# EAGLE design phoney text (EAGLE 9.6.2)
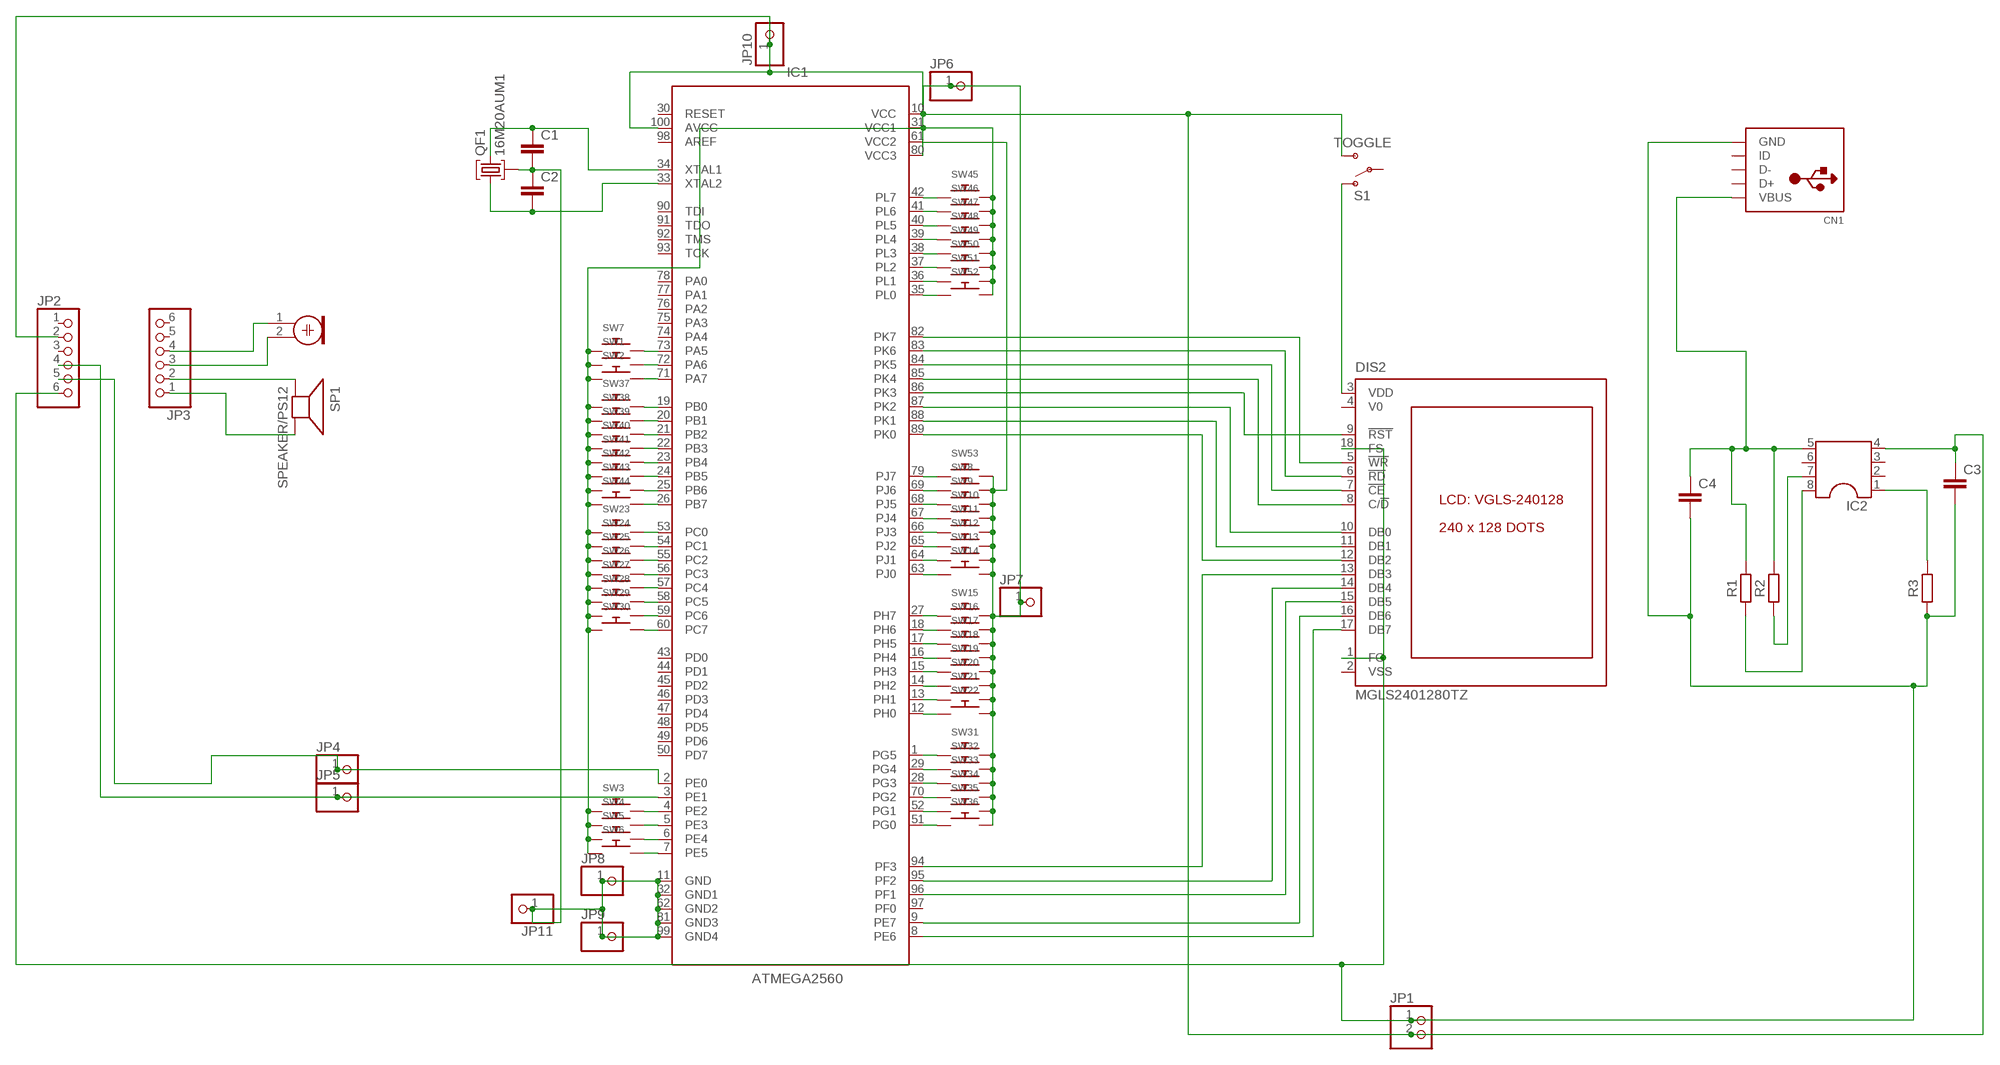
[diagram p0: schematic, sheet 1]

## Parts
C1  C2,5-3  [C2.5-3]
C2  C2,5-3  [C2.5-3]
C3  C2.5/2  [C2.5-2]
C4  C2.5/2  [C2.5-2]
CN1  USBMOLEX  [USB-MINIB-THM-MOLEX]
DIS2  MGLS2401280TZ  [MGLS2401280TZ]
IC1  ATMEGA2560  ATMEGA2560-16AUR_QFP  [QFP50P1600X1600X160-100N]
IC2  DIL8  [DIL08]
JP1  PINHD-1X2  [1X02]
JP2  PINHD-1X6CB  [1X06-CLEANBIG]
JP3  PINHD-1X6CB  [1X06-CLEANBIG]
JP4  PINHD-1X1  [1X01]
JP5  PINHD-1X1  [1X01]
JP6  PINHD-1X1  [1X01]
JP7  PINHD-1X1  [1X01]
JP8  PINHD-1X1  [1X01]
JP9  PINHD-1X1  [1X01]
JP10  PINHD-1X1  [1X01]
JP11  PINHD-1X1  [1X01]
M1  ELECTRET_MICROPHON-F6050AP  [F6050AP]
QF1  16M20AUM1  [UM1]
R1  R_CHIP-0603(1608-METRIC)  [RESC1608X60]
R2  R_CHIP-0603(1608-METRIC)  [RESC1608X60]
R3  R_CHIP-0603(1608-METRIC)  [RESC1608X60]
S1  TOGGLE  [SWITCH-SPDT-PTH-8.5X3.7MM]
SP1  SPEAKER/PS12  [PS12]
SW1  SWITCH_PUSHBUTTONSOFTTOUCHSMD_SJ  [PUSHBUTTON_SMD_SJ]
SW2  SWITCH_PUSHBUTTONSOFTTOUCHSMD_SJ  [PUSHBUTTON_SMD_SJ]
SW3  SWITCH_PUSHBUTTONSOFTTOUCHSMD_SJ  [PUSHBUTTON_SMD_SJ]
SW4  SWITCH_PUSHBUTTONSOFTTOUCHSMD_SJ  [PUSHBUTTON_SMD_SJ]
SW5  SWITCH_PUSHBUTTONSOFTTOUCHSMD_SJ  [PUSHBUTTON_SMD_SJ]
SW6  SWITCH_PUSHBUTTONSOFTTOUCHSMD_SJ  [PUSHBUTTON_SMD_SJ]
SW7  SWITCH_PUSHBUTTONSOFTTOUCHSMD_SJ  [PUSHBUTTON_SMD_SJ]
SW8  SWITCH_PUSHBUTTONSOFTTOUCHSMD_SJ  [PUSHBUTTON_SMD_SJ]
SW9  SWITCH_PUSHBUTTONSOFTTOUCHSMD_SJ  [PUSHBUTTON_SMD_SJ]
SW10  SWITCH_PUSHBUTTONSOFTTOUCHSMD_SJ  [PUSHBUTTON_SMD_SJ]
SW11  SWITCH_PUSHBUTTONSOFTTOUCHSMD_SJ  [PUSHBUTTON_SMD_SJ]
SW12  SWITCH_PUSHBUTTONSOFTTOUCHSMD_SJ  [PUSHBUTTON_SMD_SJ]
SW13  SWITCH_PUSHBUTTONSOFTTOUCHSMD_SJ  [PUSHBUTTON_SMD_SJ]
SW14  SWITCH_PUSHBUTTONSOFTTOUCHSMD_SJ  [PUSHBUTTON_SMD_SJ]
SW15  SWITCH_PUSHBUTTONSOFTTOUCHSMD_SJ  [PUSHBUTTON_SMD_SJ]
SW16  SWITCH_PUSHBUTTONSOFTTOUCHSMD_SJ  [PUSHBUTTON_SMD_SJ]
SW17  SWITCH_PUSHBUTTONSOFTTOUCHSMD_SJ  [PUSHBUTTON_SMD_SJ]
SW18  SWITCH_PUSHBUTTONSOFTTOUCHSMD_SJ  [PUSHBUTTON_SMD_SJ]
SW19  SWITCH_PUSHBUTTONSOFTTOUCHSMD_SJ  [PUSHBUTTON_SMD_SJ]
SW20  SWITCH_PUSHBUTTONSOFTTOUCHSMD_SJ  [PUSHBUTTON_SMD_SJ]
SW21  SWITCH_PUSHBUTTONSOFTTOUCHSMD_SJ  [PUSHBUTTON_SMD_SJ]
SW22  SWITCH_PUSHBUTTONSOFTTOUCHSMD_SJ  [PUSHBUTTON_SMD_SJ]
SW23  SWITCH_PUSHBUTTONSOFTTOUCHSMD_SJ  [PUSHBUTTON_SMD_SJ]
SW24  SWITCH_PUSHBUTTONSOFTTOUCHSMD_SJ  [PUSHBUTTON_SMD_SJ]
SW25  SWITCH_PUSHBUTTONSOFTTOUCHSMD_SJ  [PUSHBUTTON_SMD_SJ]
SW26  SWITCH_PUSHBUTTONSOFTTOUCHSMD_SJ  [PUSHBUTTON_SMD_SJ]
SW27  SWITCH_PUSHBUTTONSOFTTOUCHSMD_SJ  [PUSHBUTTON_SMD_SJ]
SW28  SWITCH_PUSHBUTTONSOFTTOUCHSMD_SJ  [PUSHBUTTON_SMD_SJ]
SW29  SWITCH_PUSHBUTTONSOFTTOUCHSMD_SJ  [PUSHBUTTON_SMD_SJ]
SW30  SWITCH_PUSHBUTTONSOFTTOUCHSMD_SJ  [PUSHBUTTON_SMD_SJ]
SW31  SWITCH_PUSHBUTTONSOFTTOUCHSMD_SJ  [PUSHBUTTON_SMD_SJ]
SW32  SWITCH_PUSHBUTTONSOFTTOUCHSMD_SJ  [PUSHBUTTON_SMD_SJ]
SW33  SWITCH_PUSHBUTTONSOFTTOUCHSMD_SJ  [PUSHBUTTON_SMD_SJ]
SW34  SWITCH_PUSHBUTTONSOFTTOUCHSMD_SJ  [PUSHBUTTON_SMD_SJ]
SW35  SWITCH_PUSHBUTTONSOFTTOUCHSMD_SJ  [PUSHBUTTON_SMD_SJ]
SW36  SWITCH_PUSHBUTTONSOFTTOUCHSMD_SJ  [PUSHBUTTON_SMD_SJ]
SW37  SWITCH_PUSHBUTTONSOFTTOUCHSMD_SJ  [PUSHBUTTON_SMD_SJ]
SW38  SWITCH_PUSHBUTTONSOFTTOUCHSMD_SJ  [PUSHBUTTON_SMD_SJ]
SW39  SWITCH_PUSHBUTTONSOFTTOUCHSMD_SJ  [PUSHBUTTON_SMD_SJ]
SW40  SWITCH_PUSHBUTTONSOFTTOUCHSMD_SJ  [PUSHBUTTON_SMD_SJ]
SW41  SWITCH_PUSHBUTTONSOFTTOUCHSMD_SJ  [PUSHBUTTON_SMD_SJ]
SW42  SWITCH_PUSHBUTTONSOFTTOUCHSMD_SJ  [PUSHBUTTON_SMD_SJ]
SW43  SWITCH_PUSHBUTTONSOFTTOUCHSMD_SJ  [PUSHBUTTON_SMD_SJ]
SW44  SWITCH_PUSHBUTTONSOFTTOUCHSMD_SJ  [PUSHBUTTON_SMD_SJ]
SW45  SWITCH_PUSHBUTTONSOFTTOUCHSMD_SJ  [PUSHBUTTON_SMD_SJ]
SW46  SWITCH_PUSHBUTTONSOFTTOUCHSMD_SJ  [PUSHBUTTON_SMD_SJ]
SW47  SWITCH_PUSHBUTTONSOFTTOUCHSMD_SJ  [PUSHBUTTON_SMD_SJ]
SW48  SWITCH_PUSHBUTTONSOFTTOUCHSMD_SJ  [PUSHBUTTON_SMD_SJ]
SW49  SWITCH_PUSHBUTTONSOFTTOUCHSMD_SJ  [PUSHBUTTON_SMD_SJ]
SW50  SWITCH_PUSHBUTTONSOFTTOUCHSMD_SJ  [PUSHBUTTON_SMD_SJ]
SW51  SWITCH_PUSHBUTTONSOFTTOUCHSMD_SJ  [PUSHBUTTON_SMD_SJ]
SW52  SWITCH_PUSHBUTTONSOFTTOUCHSMD_SJ  [PUSHBUTTON_SMD_SJ]
SW53  SWITCH_PUSHBUTTONSOFTTOUCHSMD_SJ  [PUSHBUTTON_SMD_SJ]

## Nets
N$1: IC1.2(PE0) JP2.5 JP4.1
N$2: IC1.3(PE1) JP2.4 JP5.1
N$5: C3.1 IC1.10(VCC) IC1.61(VCC2) IC1.80(VCC3) IC1.100(AVCC) IC2.4 JP1.2 JP2.2 JP6.1 JP7.1 JP10.1 S1.3(S) SW8.P$2 SW9.P$2 SW10.P$2 SW11.P$2 SW12.P$2 SW13.P$2 SW14.P$2 SW15.P$2 SW16.P$2 SW17.P$2 SW18.P$2 SW19.P$2 SW20.P$2 SW21.P$2 SW22.P$2 SW31.P$2 SW32.P$2 SW33.P$2 SW34.P$2 SW35.P$2 SW36.P$2 SW53.P$2
N$6: DIS2.17(DB7) IC1.8(PE6)
N$7: DIS2.12(DB2) IC1.89(PK0)
N$8: DIS2.11(DB1) IC1.88(PK1)
N$9: DIS2.10(DB0) IC1.87(PK2)
N$11: DIS2.9(!RST) IC1.86(PK3)
N$12: DIS2.8(C/!D) IC1.85(PK4)
N$13: DIS2.7(!CE) IC1.84(PK5)
N$14: DIS2.6(!RD) IC1.83(PK6)
N$15: DIS2.5(!WR) IC1.82(PK7)
N$16: IC1.73(PA5) SW7.P$2
N$17: IC1.72(PA6) SW1.P$2
N$18: IC1.71(PA7) SW2.P$2
N$19: IC1.19(PB0) SW37.P$2
N$20: IC1.20(PB1) SW38.P$2
N$21: IC1.21(PB2) SW39.P$2
N$22: IC1.22(PB3) SW40.P$2
N$23: IC1.23(PB4) SW41.P$2
N$24: IC1.24(PB5) SW42.P$2
N$25: IC1.25(PB6) SW43.P$2
N$26: IC1.26(PB7) SW44.P$2
N$27: IC1.53(PC0) SW23.P$2
N$28: IC1.54(PC1) SW24.P$2
N$29: IC1.55(PC2) SW25.P$2
N$30: IC1.56(PC3) SW26.P$2
N$31: IC1.57(PC4) SW27.P$2
N$32: IC1.58(PC5) SW28.P$2
N$33: IC1.59(PC6) SW29.P$2
N$34: IC1.60(PC7) SW30.P$2
N$35: IC1.69(PJ6) SW8.P$1
N$36: IC1.68(PJ5) SW9.P$1
N$37: IC1.67(PJ4) SW10.P$1
N$38: IC1.66(PJ3) SW11.P$1
N$39: IC1.65(PJ2) SW12.P$1
N$40: IC1.64(PJ1) SW13.P$1
N$41: IC1.63(PJ0) SW14.P$1
N$42: IC1.27(PH7) SW15.P$1
N$43: IC1.18(PH6) SW16.P$1
N$44: IC1.17(PH5) SW17.P$1
N$45: IC1.16(PH4) SW18.P$1
N$46: IC1.15(PH3) SW19.P$1
N$47: IC1.14(PH2) SW20.P$1
N$48: IC1.13(PH1) SW21.P$1
N$49: IC1.12(PH0) SW22.P$1
N$50: IC1.1(PG5) SW31.P$1
N$51: IC1.29(PG4) SW32.P$1
N$52: IC1.28(PG3) SW33.P$1
N$53: IC1.70(PG2) SW34.P$1
N$54: IC1.52(PG1) SW35.P$1
N$55: IC1.51(PG0) SW36.P$1
N$56: IC1.42(PL7) SW45.P$1
N$57: IC1.41(PL6) SW46.P$1
N$58: IC1.40(PL5) SW47.P$1
N$59: IC1.39(PL4) SW48.P$1
N$60: IC1.38(PL3) SW49.P$1
N$61: IC1.37(PL2) SW50.P$1
N$62: IC1.36(PL1) SW51.P$1
N$63: IC1.35(PL0) SW52.P$1
N$64: IC1.4(PE2) SW3.P$2
N$65: IC1.5(PE3) SW4.P$2
N$66: IC1.6(PE4) SW5.P$2
N$67: IC1.7(PE5) SW6.P$2
N$69: IC1.31(VCC1) SW1.P$1 SW2.P$1 SW3.P$1 SW4.P$1 SW5.P$1 SW6.P$1 SW7.P$1 SW23.P$1 SW24.P$1 SW25.P$1 SW26.P$1 SW27.P$1 SW28.P$1 SW29.P$1 SW30.P$1 SW37.P$1 SW38.P$1 SW39.P$1 SW40.P$1 SW41.P$1 SW42.P$1 SW43.P$1 SW44.P$1 SW45.P$2 SW46.P$2 SW47.P$2 SW48.P$2 SW49.P$2 SW50.P$2 SW51.P$2 SW52.P$2
N$72: IC1.79(PJ7) SW53.P$1
N$73: DIS2.3(VDD) S1.1(O)
N$74: C1.2 C2.1 IC1.11(GND) IC1.32(GND1) IC1.62(GND2) IC1.81(GND3) IC1.99(GND4) JP8.1 JP9.1 JP11.1 QF1.2
N$75: C1.1 IC1.34(XTAL1) QF1.3
N$76: C2.2 IC1.33(XTAL2) QF1.1
N$78: IC2.1 R3.2
N$79: IC2.8 R1.1
N$80: IC2.7 R2.1
N$81: C4.1 CN1.VBUS IC2.5 R1.2 R2.2
N$83: DIS2.13(DB3) IC1.94(PF3)
N$84: DIS2.14(DB4) IC1.95(PF2)
N$85: C3.2 C4.2 CN1.GND DIS2.1(FG) DIS2.18(FS) JP1.1 JP2.6 R3.1
N$86: JP3.1 SP1.P$2(-)
N$87: JP3.2 SP1.P$1(+)
N$88: JP3.3 M1.2
N$89: JP3.4 M1.1
N$90: DIS2.15(DB5) IC1.96(PF1)
N$91: DIS2.16(DB6) IC1.9(PE7)
Unconnected: CN1.D+ CN1.D- CN1.ID DIS2.2(VSS) DIS2.4(V0) IC1.30(RESET) IC1.43(PD0) IC1.44(PD1) IC1.45(PD2) IC1.46(PD3) IC1.47(PD4) IC1.48(PD5) IC1.49(PD6) IC1.50(PD7) IC1.74(PA4) IC1.75(PA3) IC1.76(PA2) IC1.77(PA1) IC1.78(PA0) IC1.90(TDI) IC1.91(TDO) IC1.92(TMS) IC1.93(TCK) IC1.97(PF0) IC1.98(AREF) IC2.2 IC2.3 IC2.6 JP2.1 JP2.3 JP3.5 JP3.6 S1.2(P)

## Library data of the parts
C1-C4 = capacitor-wima:C: CAPACITOR naming: grid - package width
CN1 = adafruit:USB: USB Connectors USBMINIB - Surface Mount Female Mini-B USB Connector 4UConnector: 06564 By microbuilder.eu Thru-hole RA Female Mini-B USB Connector 4UConnector: 18732 By ladyada.net
DIS2 = display-lcd:MGLS2401280TZ: LCD Display 240 x 128 Dots Source: VARITRONIX LIMITED .. LCD_f1187192714.pdf; OC_FARNELL: 1183196; OC_NEWARK: unknown
IC1 = IC_Embedded:ATMEGA2560*: 8-bit Microcontroller with 16/32/64KB In-System Programmable Flash Datasheet <https://ww1.microchip.com/downloads/en/DeviceDoc/ATmega640-1280-1281-2560-2561-Datasheet-DS40002211A.pdf>; CATEGORY: IC_Embedded; DESCRIPTION: IC MCU 8BIT 256KB FLASH 100TQFP; MANUFACTURER: Microchip Technology; MPN: ATMEGA2560-16AUR; OPERATING_TEMP: -40°C to 85°C; PART_STATUS: Active; SERIES: AVR® ATmega; SPEED: 16MHz; SUB-CATEGORY: Microcontroller
IC2 = ic-package:DIL8: Dual In Line / Socket
JP1 = pinhead:PINHD-1X2: PIN HEADER
JP2 JP3 = adafruit:PINHD-1X6: PIN HEADER
JP4-JP9 = pinhead:PINHD-1X1: PIN HEADER
JP10 JP11 = adafruit:PINHD-1X1: Pin header 1x1 for 0.1" spacing With round pins
M1 = microphon:ELECTRET_MICROPHON-: Electret Condenser Microphone
QF1 = crystal:16M20AUM1: Monolithic Crystal Filters Source: www.vanlong.com; OC_FARNELL: unknown; OC_NEWARK: unknown
R1-R3 = Resistor:R: Resistor Fixed - Generic; CATEGORY: Resistor; SUB-CATEGORY: Fixed
S1 = Tinkercad:TOGGLE
SP1 = adafruit:SPEAKER: SPEAKER Source: Buerklin Added PS12 (for part # PS1240 piezo) http://www.ladyada.net/library/pcb/eaglelibrary.html
SW1-SW53 = adafruit:SWITCH_PUSHBUTTON: Buttons SOFTTOUCHSMD_SJ - Soft touch temporary push button (Super Junk Akihabara) Compatible with SKPMANE010 [Mouser: 688-SKPMAN] C&K_KSS = Digikey: KSS221GLFS

## Board
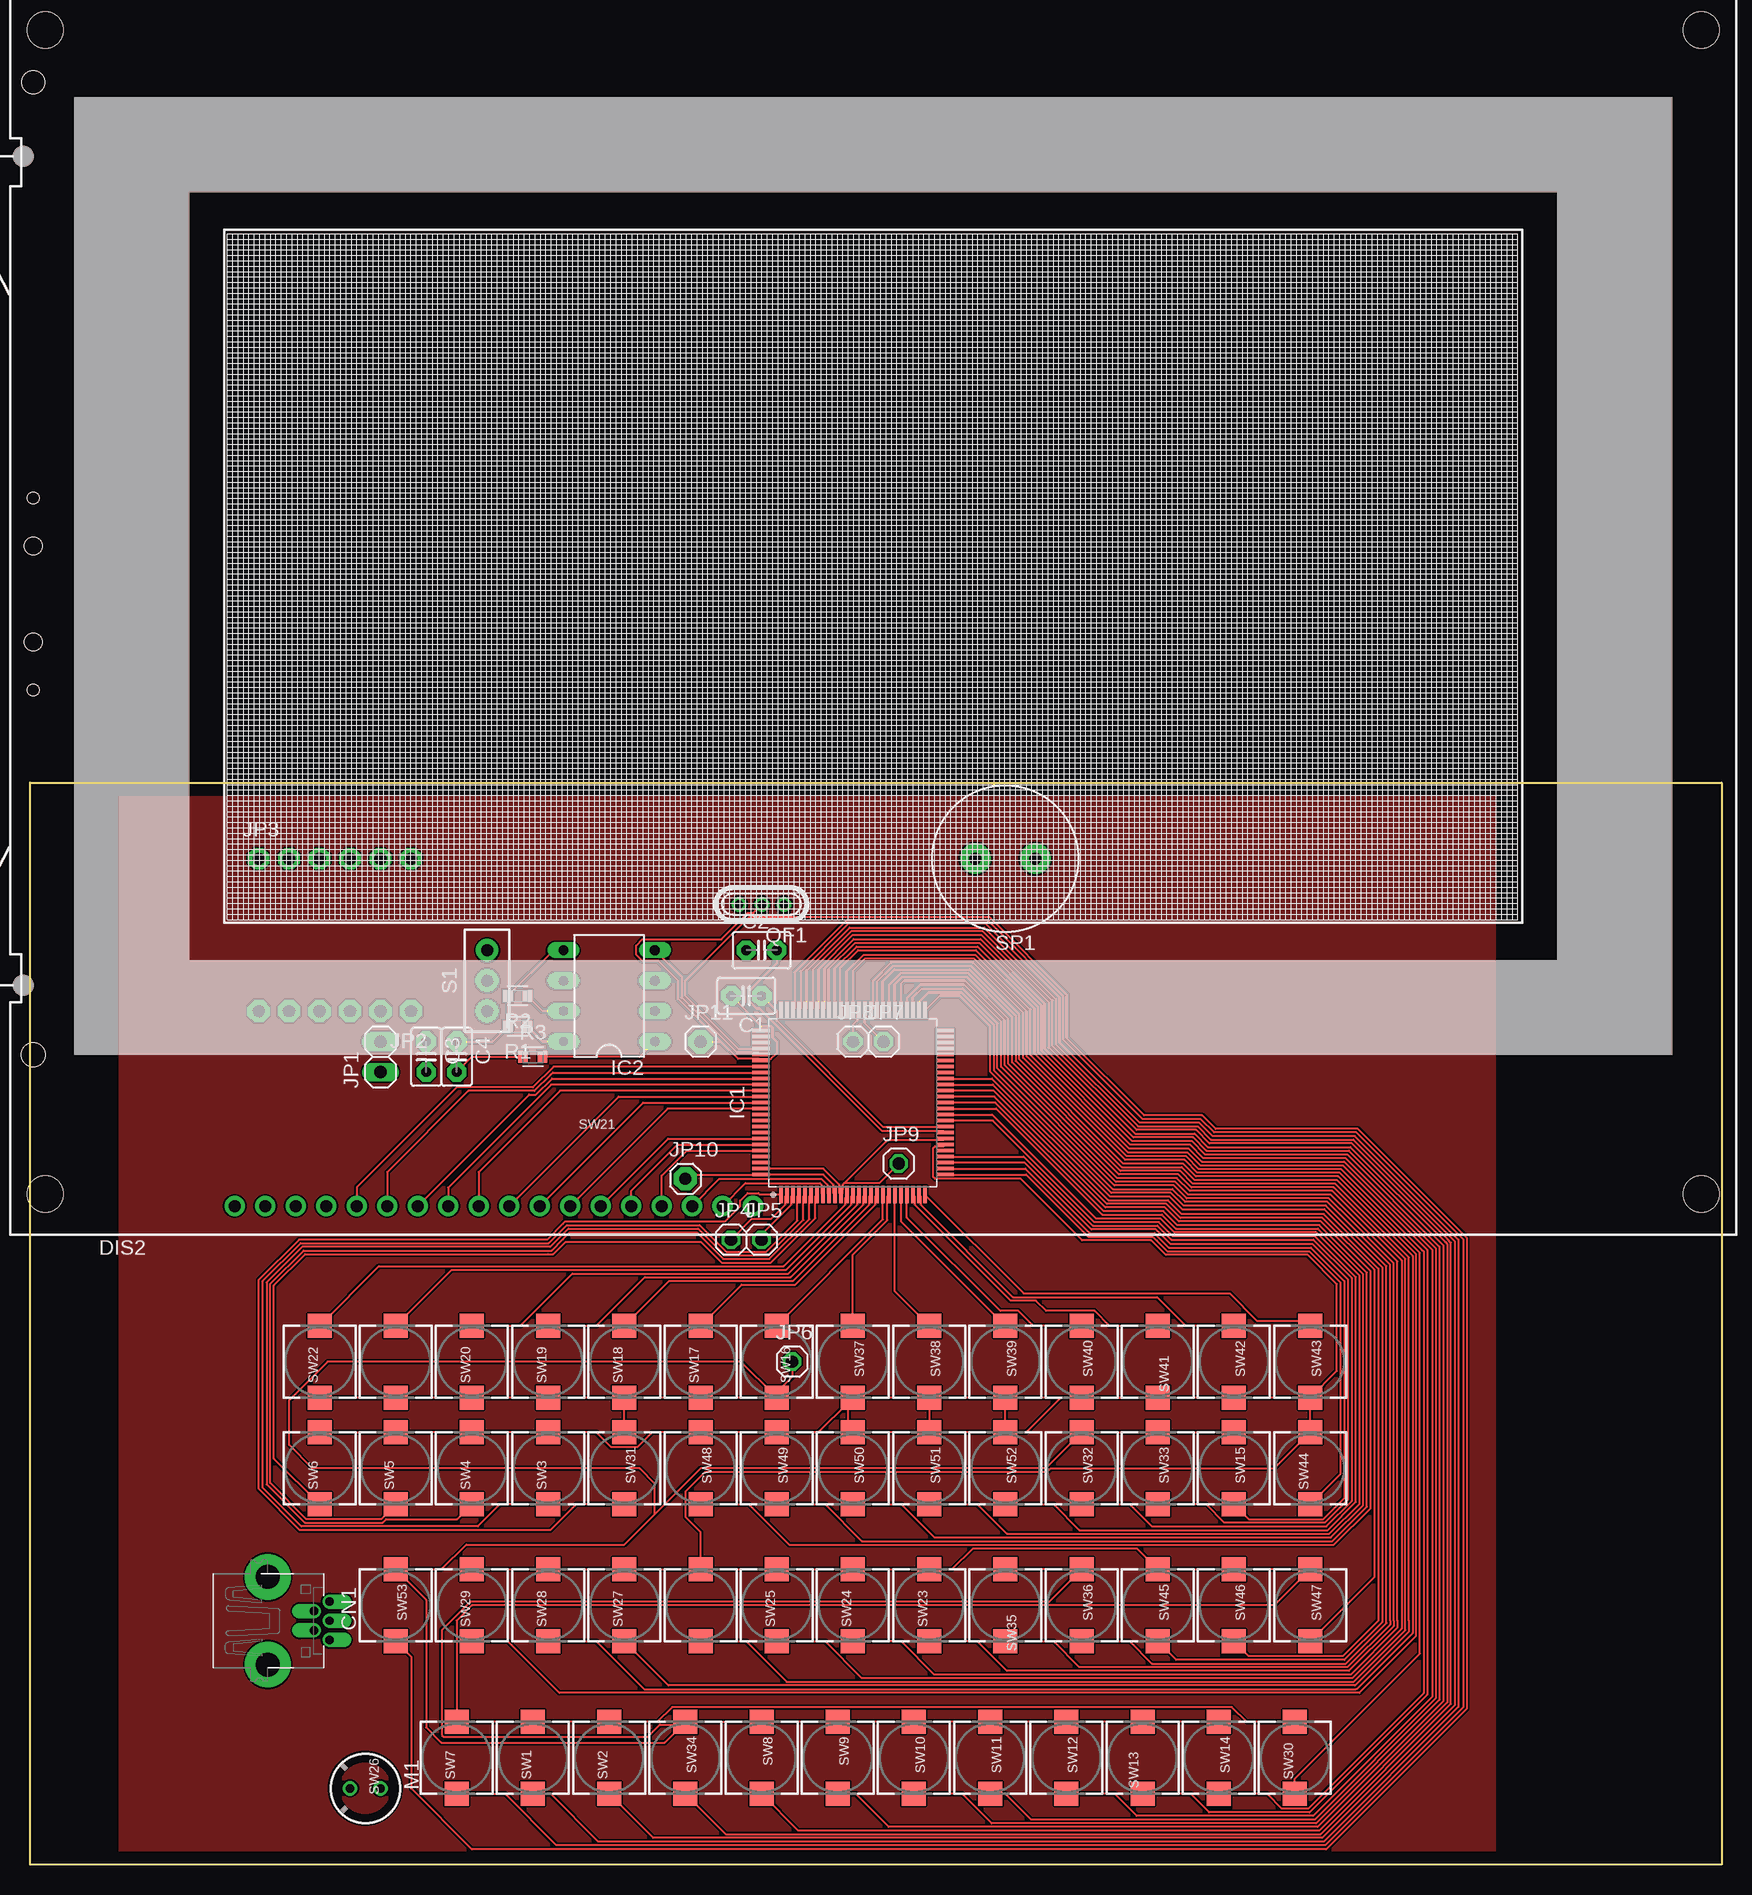
[diagram p1: board, top side]
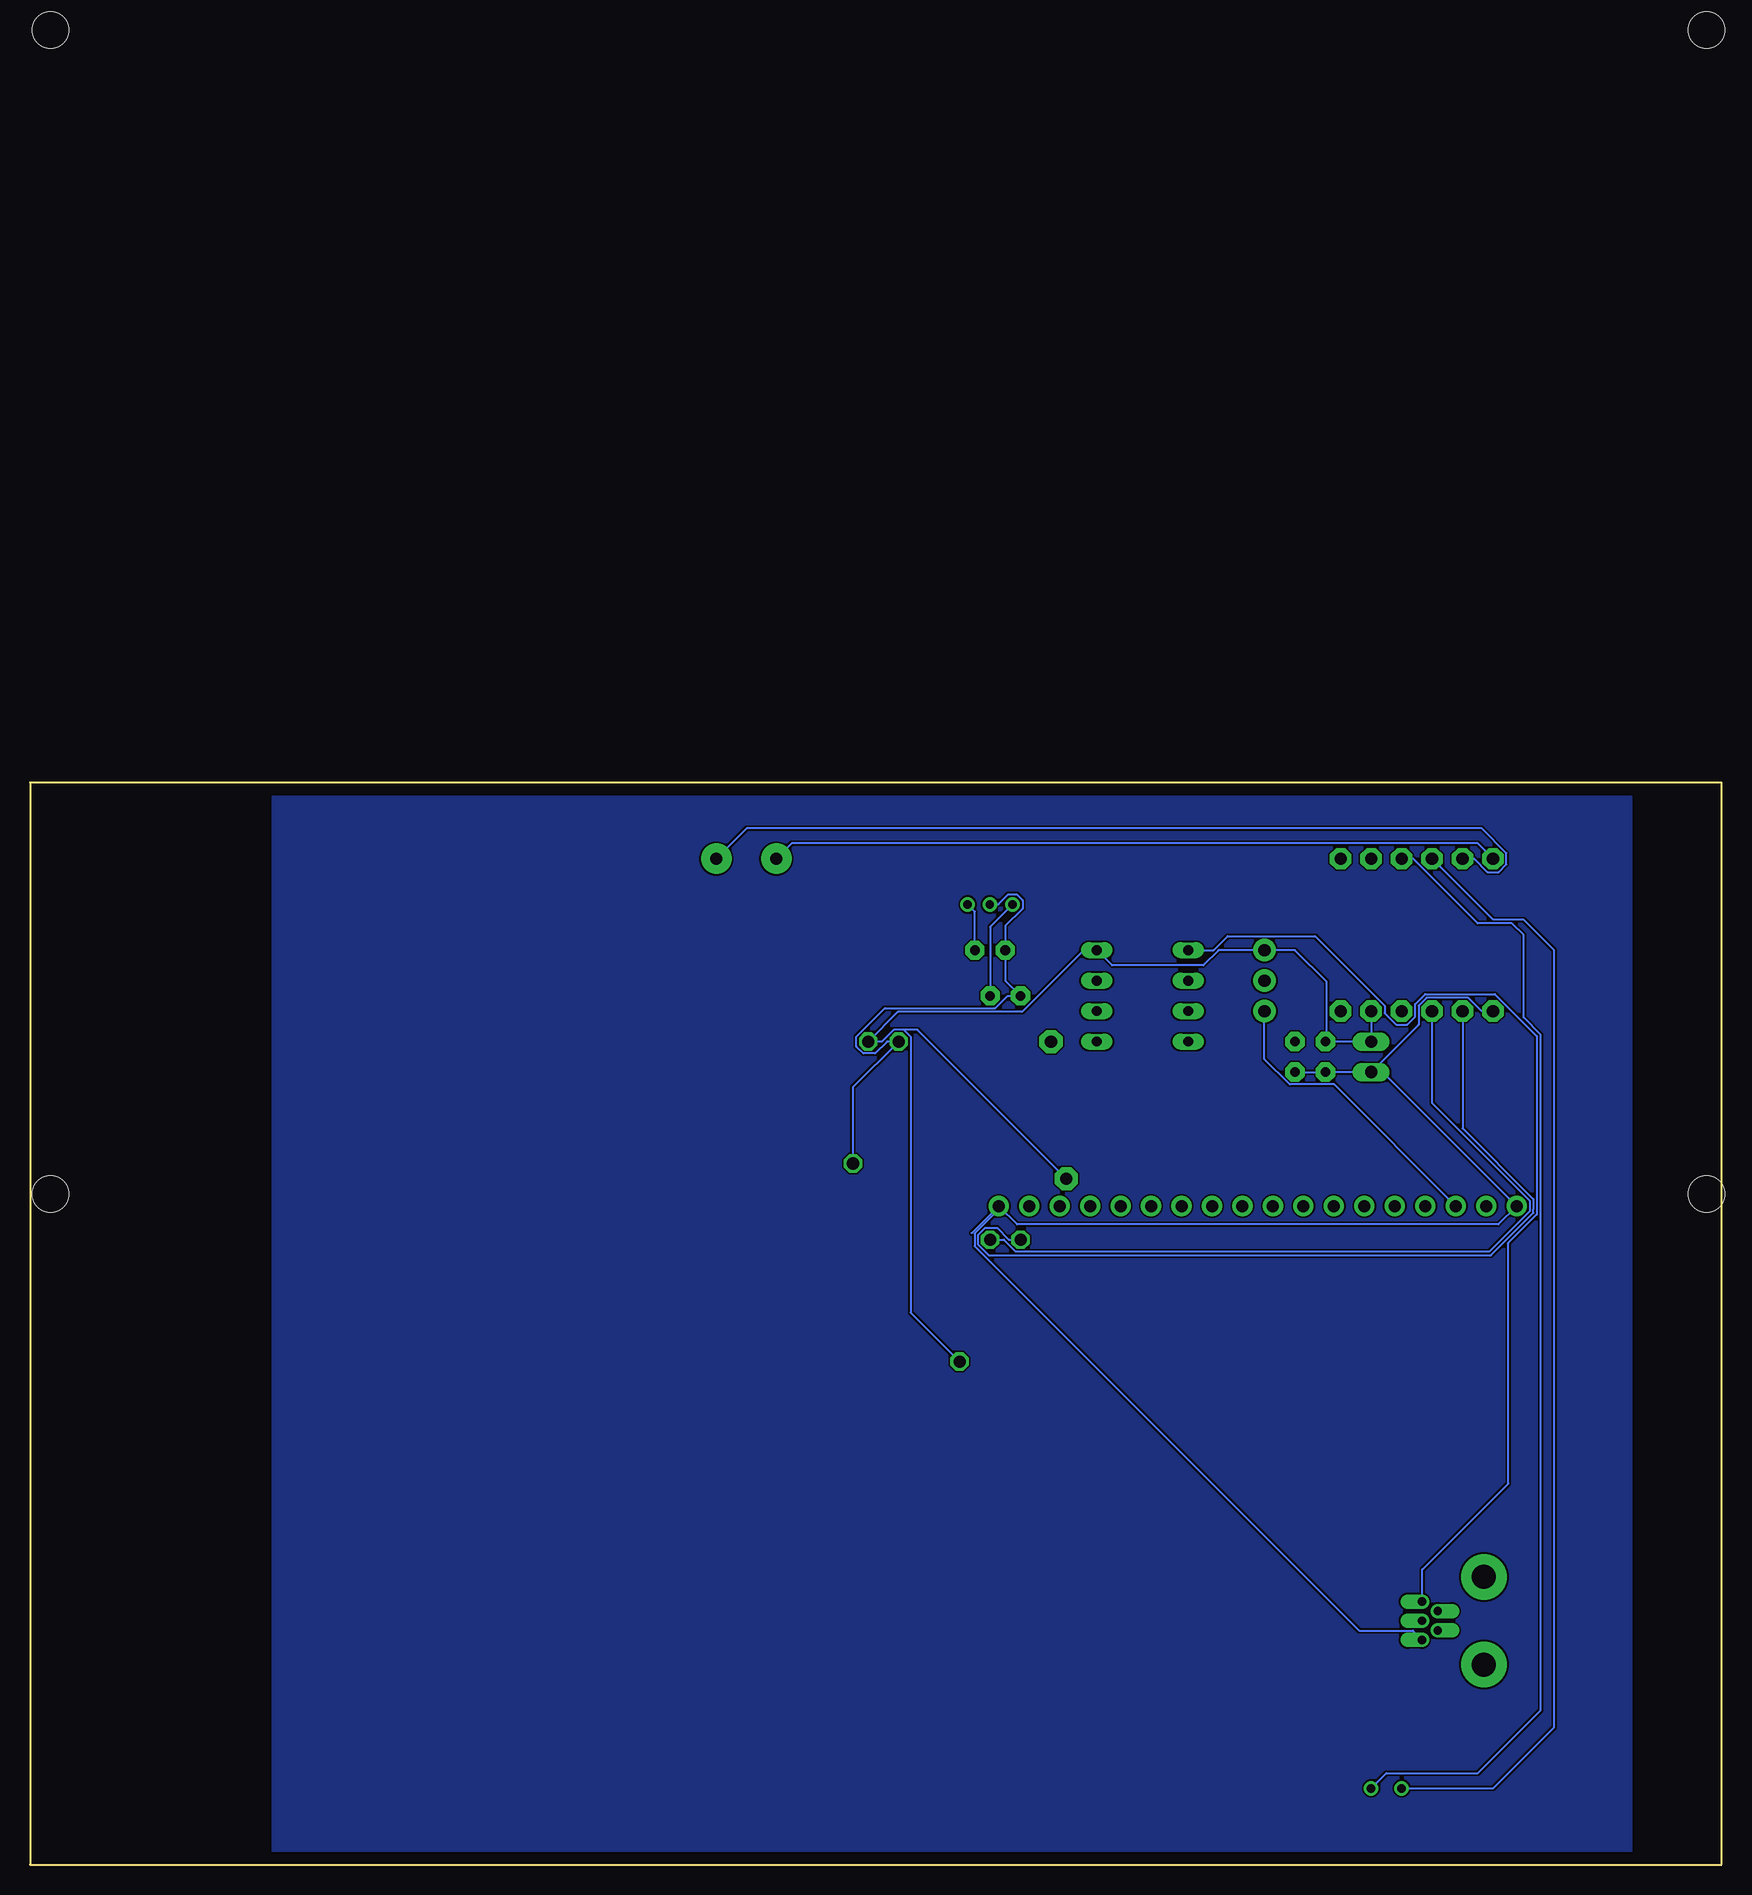
[diagram p2: board, bottom side, seen from below]

Size 140.97 x 90.17 mm. Coordinates in mm from the lower left corner, seen from the top.
Outline: 0,90.17 140.97,90.17 140.97,0 0,0 0,90.17
Copper layers (1*16): Top 0.035mm / dielectric 1.5mm / Bottom 0.035mm
Design rules "default": minimum track width 6mil, minimum drill 0.35mm, track to track 6mil, track to pad 6mil, pad to pad 6mil, via to via 6mil, smd to smd 6mil, copper to edge 40mil, drill to drill 6mil, minimum pad ring 10mil, minimum via ring 8mil, stop-mask expansion 4mil, vias tented up to drill 0mil, thermal gap 10mil

### Footprints (pad centres in the part's own frame; a part is rotated, then mirrored left to right if it is on the bottom)
C2.5-3 = drill 0.813 pad 1.6 octagon: 1 -1.27,0; 2 1.27,0
C2.5-2 = drill 0.813 pad 1.6 octagon: 1 -1.27,0; 2 1.27,0
USB-MINIB-THM-MOLEX = drill 0.7 offset: D+ 0,9.72; D- -0.8,8.42; GND 1.6,9.72; ID 0.8,8.42; VBUS -1.6,9.72 | drill 2 pad 3.81: GND1 -3.65,4.57; GND4 3.65,4.57
MGLS2401280TZ = drill 1 pad 1.676: 1 15.8,-1; 2 18.34,-1; 3 20.88,-1; 4 23.42,-1; 5 25.96,-1; 6 28.5,-1; 7 31.04,-1; 8 33.58,-1; 9 36.12,-1; 10 38.66,-1; 11 41.2,-1; 12 43.74,-1; 13 46.28,-1; 14 48.82,-1; 15 51.36,-1; 16 53.9,-1; 17 56.44,-1; 18 58.98,-1 | hole 3: 0,0; 138,0; 0,97; 138,97
QFP50P1600X1600X160-100N = smd 1.469 x 0.28: 1 -7.671,6; 2 -7.671,5.5; 3 -7.671,5; 4 -7.671,4.5; 5 -7.671,4; 6 -7.671,3.5; 7 -7.671,3; 8 -7.671,2.5; 9 -7.671,2; 10 -7.671,1.5; 11 -7.671,1; 12 -7.671,0.5; 13 -7.671,0; 14 -7.671,-0.5; 15 -7.671,-1; 16 -7.671,-1.5; 17 -7.671,-2; 18 -7.671,-2.5; 19 -7.671,-3; 20 -7.671,-3.5; 21 -7.671,-4; 22 -7.671,-4.5; 23 -7.671,-5; 24 -7.671,-5.5; 25 -7.671,-6; 51 7.671,-6; 52 7.671,-5.5; 53 7.671,-5; 54 7.671,-4.5; 55 7.671,-4; 56 7.671,-3.5; 57 7.671,-3; 58 7.671,-2.5; 59 7.671,-2; 60 7.671,-1.5; 61 7.671,-1; 62 7.671,-0.5; 63 7.671,0; 64 7.671,0.5; 65 7.671,1; 66 7.671,1.5; 67 7.671,2; 68 7.671,2.5; 69 7.671,3; 70 7.671,3.5; 71 7.671,4; 72 7.671,4.5; 73 7.671,5; 74 7.671,5.5; 75 7.671,6 | smd 0.28 x 1.469: 26 -6,-7.671; 27 -5.5,-7.671; 28 -5,-7.671; 29 -4.5,-7.671; 30 -4,-7.671; 31 -3.5,-7.671; 32 -3,-7.671; 33 -2.5,-7.671; 34 -2,-7.671; 35 -1.5,-7.671; 36 -1,-7.671; 37 -0.5,-7.671; 38 0,-7.671; 39 0.5,-7.671; 40 1,-7.671; 41 1.5,-7.671; 42 2,-7.671; 43 2.5,-7.671; 44 3,-7.671; 45 3.5,-7.671; 46 4,-7.671; 47 4.5,-7.671; 48 5,-7.671; 49 5.5,-7.671; 50 6,-7.671; 76 6,7.671; 77 5.5,7.671; 78 5,7.671; 79 4.5,7.671; 80 4,7.671; 81 3.5,7.671; 82 3,7.671; 83 2.5,7.671; 84 2,7.671; 85 1.5,7.671; 86 1,7.671; 87 0.5,7.671; 88 0,7.671; 89 -0.5,7.671; 90 -1,7.671; 91 -1.5,7.671; 92 -2,7.671; 93 -2.5,7.671; 94 -3,7.671; 95 -3.5,7.671; 96 -4,7.671; 97 -4.5,7.671; 98 -5,7.671; 99 -5.5,7.671; 100 -6,7.671
DIL08 = drill 0.813 long: 1 -3.81,-3.81; 2 -1.27,-3.81; 3 1.27,-3.81; 4 3.81,-3.81; 5 3.81,3.81; 6 1.27,3.81; 7 -1.27,3.81; 8 -3.81,3.81
1X02 = drill 1.016 long: 1 -1.27,0; 2 1.27,0
1X06-CLEANBIG = drill 1.016 pad 1.778 octagon: 1 -6.35,0; 2 -3.81,0; 3 -1.27,0; 4 1.27,0; 5 3.81,0; 6 6.35,0
1X01 = drill 1.016 octagon: 1 0,0
1X01' = drill 1.016 pad 1.93 octagon: 1 0,0
F6050AP = drill 0.7 pad 1.2: 1 0,1.27; 2 0,-1.27
UM1 = drill 0.7 pad 1.2: 1 -1.875,0; 2 -0.027,0; 3 1.875,0
RESC1608X60 = smd 0.799 x 0.974: 1 -0.815,0; 2 0.815,0
SWITCH-SPDT-PTH-8.5X3.7MM = drill 1.016 pad 1.88: 1 -2.54,0; 2 0,0; 3 2.54,0
PS12 = drill 1 pad 2.54: P$1 -2.5,0; P$2 2.5,0
PUSHBUTTON_SMD_SJ = smd 2 x 2: P$1 3,0; P$2 -3,0

### Placement (x,y rotation side)
C1  59.69,72.39 180 top
C2  60.96,76.2 0 top
C3  33.02,67.31 270 top
C4  35.56,67.31 270 top
CN1  15.24,20.32 270 top
DIS2  1.27,55.88 0 top
IC1  68.58,63.5 90 top
IC2  48.26,72.39 90 top
JP1  29.21,67.31 90 top
JP2  25.4,71.12 180 top
JP3  25.4,83.82 0 top
JP4  58.42,52.07 0 top
JP5  60.96,52.07 0 top
JP6  63.5,41.91 0 top
JP7  71.12,68.58 0 top
JP8  68.58,68.58 0 top
JP9  72.39,58.42 0 top
JP10  [1X01']  54.61,57.15 0 top
JP11  [1X01']  55.88,68.58 0 top
M1  27.94,6.35 270 top
QF1  60.96,80.01 180 top
R1  40.64,69.85 180 top
R2  40.64,72.39 180 top
R3  41.91,67.31 0 top
S1  38.1,73.66 90 top
SP1  81.28,83.82 180 top
SW1  41.91,8.89 90 top
SW2  48.26,8.89 90 top
SW3  43.18,33.02 90 top
SW4  36.83,33.02 90 top
SW5  30.48,33.02 90 top
SW6  24.13,33.02 90 top
SW7  35.56,8.89 90 top
SW8  60.96,8.89 270 top
SW9  67.31,8.89 270 top
SW10  73.66,8.89 270 top
SW11  80.01,8.89 270 top
SW12  86.36,8.89 270 top
SW13  92.71,8.89 270 top
SW14  99.06,8.89 270 top
SW15  100.33,33.02 270 top
SW16  62.23,41.91 90 top
SW17  55.88,41.91 90 top
SW18  49.53,41.91 90 top
SW19  43.18,41.91 90 top
SW20  36.83,41.91 90 top
SW21  30.48,41.91 90 top
SW22  24.13,41.91 90 top
SW23  74.93,21.59 90 top
SW24  68.58,21.59 90 top
SW25  62.23,21.59 90 top
SW26  55.88,21.59 90 top
SW27  49.53,21.59 90 top
SW28  43.18,21.59 90 top
SW29  36.83,21.59 90 top
SW30  105.41,8.89 90 top
SW31  49.53,33.02 270 top
SW32  87.63,33.02 270 top
SW33  93.98,33.02 270 top
SW34  54.61,8.89 270 top
SW35  81.28,21.59 270 top
SW36  87.63,21.59 270 top
SW37  68.58,41.91 270 top
SW38  74.93,41.91 270 top
SW39  81.28,41.91 270 top
SW40  87.63,41.91 270 top
SW41  93.98,41.91 270 top
SW42  100.33,41.91 270 top
SW43  106.68,41.91 270 top
SW44  106.68,33.02 90 top
SW45  93.98,21.59 270 top
SW46  100.33,21.59 270 top
SW47  106.68,21.59 270 top
SW48  55.88,33.02 270 top
SW49  62.23,33.02 270 top
SW50  68.58,33.02 270 top
SW51  74.93,33.02 270 top
SW52  81.28,33.02 270 top
SW53  30.48,21.59 270 top

### Tracks (layer width: path | path; a pad name or v marks a point on that pad's centre or on a via)
1
  pour Top: 8.89,90.17 121.92,90.17 121.92,0 7.62,0 7.62,90.17
N$1
  Top 0.152: JP4.1 60.16,53.81 61.76,53.81 62.95,55 62.95,55.7 IC1.2
  Bottom 0.152: JP2.5 21.59,61.34 15.7,55.45 15.7,54.61 15.7,54.31 19.24,50.77 61.07,50.77 61.95,51.66 61.95,52.48 61.37,53.06 60.38,53.06 59.39,52.07 JP4.1
N$2
  Top 0.152: IC1.3 63.45,55.7 63.45,55 60.96,52.51 JP5.1
  Bottom 0.152: JP5.1 59.82,52.07 58.83,51.08 19.36,51.08 16,54.44 16,55.32 24.13,63.45 JP2.4
N$5
  Top 0.152: SW22.P$2 SW21.P$2 SW20.P$2 SW19.P$2 SW18.P$2 | SW18.P$2 SW17.P$2 SW16.P$2 62,39.14 | SW31.P$2 SW18.P$2 | SW35.P$2 SW36.P$2 84.93,21.89 36.7,21.89 34.33,19.52 34.33,10.8 34.47,10.66 51.49,10.66 52.49,11.66 54.38,11.66 | SW14.P$2 SW13.P$2 SW12.P$2 SW11.P$2 SW10.P$2 SW9.P$2 SW8.P$2 SW34.P$2 54.38,11.66 | 52.07,29.21 49.53,26.67 36.37,26.67 34.29,24.59 SW53.P$2 33.02,22.05 33.02,11.43 34.29,10.16 52.88,10.16 54.38,11.66 | 52.07,29.21 52.07,31.75 50.8,33.02 23.54,33.02 21.59,34.97 21.59,38.69 24.81,41.91 59.23,41.91 62,39.14 | 52.07,29.21 55.88,33.02 84.63,33.02 SW32.P$2 SW33.P$2 SW15.P$2 | IC2.4 54.3,73.96 54.3,72.26 58.94,67.63 60.78,67.63 IC1.80 | IC1.10 66.95,55.96 66.95,56.66 66.11,57.5 IC1.100 54.96,57.5 JP10.1 | JP7.1 69.58,70.12 IC1.61 | JP6.1 63.5,40.64 62,39.14
  Bottom 0.152: 68.17,69.57 67.59,68.99 67.59,46 JP6.1 | 68.17,69.57 68.99,69.57 69.98,68.58 JP7.1 68.64,71.06 58.3,71.06 53.16,76.2 IC2.4 50.8,74.93 43.18,74.93 41.91,76.2 S1.3 35.56,76.2 32.92,73.56 32.92,68.68 C3.1 JP1.2 JP2.2 | 68.17,69.57 67.03,69.57 JP10.1
N$6
  Top 0.152: IC1.8 65.95,55.96 65.95,56.66 65.81,56.79 59.62,56.79 DIS2.17
N$7
  Top 0.152: IC1.89 53.13,63 DIS2.12
N$8
  Top 0.152: DIS2.11 51.09,63.5 IC1.88
N$9
  Top 0.152: DIS2.10 49.05,64 IC1.87
N$11
  Top 0.152: IC1.86 44.18,64.5 37.39,57.71 DIS2.9
N$12
  Top 0.152: IC1.85 43.43,65 34.85,56.42 DIS2.8
N$13
  Top 0.152: DIS2.7 41.59,64.16 42.16,64.16 43.5,65.5 IC1.84
N$14
  Top 0.152: DIS2.6 29.77,57.71 36.52,64.46 42.04,64.46 43.4,65.82 43.57,66 IC1.83
N$15
  Top 0.152: IC1.82 43.64,66.5 41.91,64.77 35.56,64.77 27.23,56.44 DIS2.5
N$16
  Top 0.152: SW7.P$2 36.83,5.89 37.05,5.89 39.59,5.89 43.86,1.61 107.93,1.61 119.42,13.11 119.42,52.11 110.53,61.01 98.67,61.01 97.55,62.13 92.71,62.13 86.11,68.73 86.11,72.38 79.79,78.69 68.05,78.69 63.71,74.35 63.71,71.3 IC1.73
N$17
  Top 0.152: SW1.P$2 43.4,5.89 47.37,1.92 107.81,1.92 119.02,13.14 119.02,52.08 118.57,52.53 110.4,60.71 98.54,60.71 97.42,61.82 92.46,61.82 85.8,68.48 85.8,72.25 79.67,78.38 68.18,78.38 64.21,74.42 64.21,71.3 IC1.72
N$18
  Top 0.152: IC1.71 64.71,71.3 64.71,74.49 68.3,78.08 79.54,78.08 85.5,72.12 85.5,68.36 92.34,61.52 97.3,61.52 98.42,60.4 110.27,60.4 118.36,52.32 118.72,51.96 118.72,13.26 107.68,2.22 51.93,2.22 SW2.P$2
N$19
  Top 0.152: SW37.P$2 68.58,50.83 71.45,53.7 71.45,55.7 IC1.19
N$20
  Top 0.152: SW38.P$2 72.08,47.76 IC1.20
N$21
  Top 0.152: IC1.21 72.58,53.61 SW39.P$2
N$22
  Top 0.152: SW40.P$2 83.6,44.91 82.38,46.14 80.86,46.14 73.08,53.92 IC1.22
N$23
  Top 0.152: SW41.P$2 89.95,44.91 88.72,46.14 84.67,46.14 83.82,46.99 81.72,46.99 73.71,55 73.71,55.7 IC1.23
N$24
  Top 0.152: IC1.24 74.21,55.7 74.21,55 81.92,47.3 93.92,47.3 96.3,44.91 SW42.P$2
N$25
  Top 0.152: SW43.P$2 106.27,45.31 102.25,45.31 99.96,47.6 82.81,47.6 IC1.25
N$26
  Top 0.152: SW44.P$2 109.22,32.56 109.22,48.5 106.62,51.11 94.78,51.11 93.9,51.99 93.56,52.32 88.19,52.32 83.02,57.5 IC1.26
N$27
  Top 0.152: SW23.P$2 78.96,18.59 81.41,16.14 109.92,16.14 113.64,19.87 113.64,20.32 113.64,50.12 109.17,54.59 109.17,54.61 109.15,54.61 108.23,55.52 96.4,55.52 95.33,56.59 90.37,56.59 80.62,66.34 80.62,70.1 77.72,73 74.32,73 73.58,72.26 IC1.53
N$28
  Top 0.152: SW24.P$2 72.61,18.59 75.36,15.84 110.04,15.84 113.94,19.74 113.94,20.32 113.94,50.27 108.38,55.83 96.52,55.83 95.45,56.9 90.49,56.9 80.92,66.46 80.92,70.23 77.85,73.3 74.19,73.3 73.08,72.19 IC1.54
N$29
  Top 0.152: SW25.P$2 66.04,18.59 66.26,18.59 69.31,15.53 110.17,15.53 114.3,19.66 114.3,50.34 108.51,56.13 96.65,56.13 95.58,57.2 90.62,57.2 81.23,66.59 81.23,70.35 77.92,73.66 72.82,73.66 72.58,73.42 IC1.55
N$30
  Top 0.152: SW26.P$2 59.69,18.59 63.05,15.23 110.3,15.23 114.21,19.14 114.6,19.54 114.6,50.47 108.63,56.44 96.77,56.44 95.71,57.51 90.75,57.51 81.53,66.72 81.53,70.48 78.05,73.96 72.69,73.96 72.08,73.35 IC1.56
N$31
  Top 0.152: IC1.57 71.58,73.28 72.57,74.27 78.18,74.27 81.84,70.61 81.84,66.84 90.87,57.81 95.83,57.81 96.9,56.74 108.76,56.74 114.91,50.59 114.91,20.32 114.91,19.41 110.42,14.92 53.2,14.92 SW27.P$2
N$32
  Top 0.152: IC1.58 71.08,73.62 72.03,74.57 78.3,74.57 82.14,70.73 82.14,66.97 91,58.12 95.96,58.12 97.03,57.05 108.89,57.05 115.21,50.72 115.21,19.29 110.55,14.62 110.49,14.62 51.18,14.62 47.21,18.59 SW28.P$2
N$33
  Top 0.152: SW29.P$2 39.83,18.59 44.11,14.31 110.78,14.31 115.52,19.05 115.52,50.85 109.01,57.35 97.15,57.35 96.09,58.42 91.12,58.42 82.45,67.1 82.45,70.86 78.43,74.88 71.91,74.88 70.58,73.55 IC1.59
N$34
  Top 0.152: SW30.P$2 105.41,7.16 115.82,17.57 115.82,50.97 109.14,57.66 97.28,57.66 96.21,58.73 91.25,58.73 82.75,67.22 82.75,70.99 78.56,75.18 71.78,75.18 70.21,73.61 70.21,71.3 IC1.60
N$35
  Top 0.152: IC1.69 65.71,71.3 65.71,74.62 68.56,77.47 79.29,77.47 84.89,71.87 84.89,68.11 92.08,60.91 97.05,60.91 98.16,59.79 110.02,59.79 117.93,51.89 118.11,51.7 118.11,13.52 107.43,2.83 64.02,2.83 SW8.P$1
N$36
  Top 0.152: SW9.P$1 68.8,5.89 71.55,3.14 107.3,3.14 117.75,13.59 117.75,51.63 109.9,59.49 98.04,59.49 96.92,60.6 91.96,60.6 84.58,67.98 84.58,71.74 79.21,77.11 68.63,77.11 66.21,74.69 66.21,71.3 IC1.68
N$37
  Top 0.152: IC1.67 66.58,74.63 68.76,76.81 79.08,76.81 84.28,71.62 84.28,67.85 91.83,60.3 96.79,60.3 97.91,59.18 109.77,59.18 117.45,51.5 117.45,13.72 107.17,3.44 80.13,3.44 77.69,5.89 SW10.P$1
N$38
  Top 0.152: SW11.P$1 81.28,5.89 83.42,3.75 107.05,3.75 117.14,13.84 117.14,51.38 116.64,51.88 109.64,58.88 97.78,58.88 96.67,59.99 91.7,59.99 83.97,67.73 83.97,71.49 78.96,76.5 68.89,76.5 67.08,74.7 IC1.66
N$39
  Top 0.152: SW12.P$1 87.63,5.89 87.85,5.89 90.39,5.89 92.22,4.05 106.92,4.05 116.84,13.97 116.84,51.25 109.52,58.57 97.66,58.57 96.54,59.69 91.58,59.69 83.67,67.6 83.67,71.36 78.83,76.2 69.01,76.2 67.53,74.71 67.53,71.23 IC1.65
N$40
  Top 0.152: SW13.P$1 93.98,5.89 94.2,5.89 96.74,5.89 98.27,4.36 106.63,4.36 116.43,14.16 116.43,51.23 109.39,58.27 97.53,58.27 96.46,59.33 91.5,59.33 83.36,67.47 83.36,71.24 78.81,75.79 69.44,75.79 68.08,74.43 IC1.64
N$41
  Top 0.152: IC1.63 68.58,74.5 69.57,75.49 78.68,75.49 83.06,71.11 83.06,67.35 91.38,59.03 96.34,59.03 97.41,57.96 109.27,57.96 116,51.23 116.13,51.1 116.13,14.29 106.5,4.66 104.31,4.66 103.09,5.89 SW14.P$1
N$42
  Top 0.152: SW15.P$1 101.56,28.79 107.77,28.79 109.52,30.54 109.52,48.63 106.74,51.41 94.91,51.41 93.69,52.63 88.32,52.63 82.95,58 IC1.27
N$43
  Top 0.152: SW16.P$1 71.08,53.76 IC1.18
N$44
  Top 0.152: SW17.P$1 59.31,48.34 63.79,48.34 70.45,55 70.45,55.7 IC1.17
N$45
  Top 0.152: SW18.P$1 53.26,48.64 63.59,48.64 69.95,55 69.95,55.7 IC1.16
N$46
  Top 0.152: IC1.15 69.45,55.7 69.45,55 63.4,48.95 51.24,48.95 47.21,44.91 SW19.P$1
N$47
  Top 0.152: IC1.14 68.95,55.7 68.95,55 63.2,49.25 45.2,49.25 40.86,44.91 SW20.P$1
N$48
  Top 0.152: IC1.13 68.45,55.7 68.45,55.01 63.01,49.55 35.12,49.55 SW21.P$1
N$49
  Top 0.152: IC1.12 68.15,55.76 67.95,55.56 67.95,55 62.81,49.86 29.08,49.86 SW22.P$1
N$50
  Top 0.152: SW31.P$1 45.5,30.02 43.36,27.88 22.49,27.88 19.05,31.32 19.05,48.71 22.42,52.08 43.09,52.08 44.4,53.39 44.61,53.59 57.93,53.59 59.18,54.84 59.18,55.32 59.81,55.95 60.69,55.95 60.76,55.88 62.53,55.88 IC1.1
N$51
  Top 0.152: SW32.P$1 91.66,30.02 93.49,28.18 108.03,28.18 110.13,30.29 110.13,48.88 106.95,52.07 95.11,52.07 93.94,53.24 88.57,53.24 82.81,59 IC1.29
N$52
  Top 0.152: SW33.P$1 98.01,30.02 99.54,28.49 107.9,28.49 109.83,30.41 109.83,48.76 106.87,51.71 95.03,51.71 93.81,52.93 88.44,52.93 82.88,58.5 IC1.28
N$53
  Top 0.152: IC1.70 65.21,71.3 65.21,74.56 68.43,77.77 79.41,77.77 85.19,72 85.19,68.23 92.21,61.21 97.17,61.21 98.29,60.1 110.15,60.1 118.14,52.1 118.41,51.83 118.41,13.39 107.55,2.53 57.97,2.53 SW34.P$1
N$54
  Top 0.152: SW35.P$1 85.09,18.59 85.31,18.59 87.45,16.45 109.79,16.45 113.33,19.99 113.33,20.32 113.33,49.99 108.11,55.22 96.27,55.22 95.2,56.29 90.24,56.29 80.31,66.21 80.31,69.98 77.6,72.69 74.91,72.69 74.08,71.87 IC1.52
N$55
  Top 0.152: SW36.P$1 91.66,18.59 93.49,16.75 109.66,16.75 113.03,20.12 113.03,49.87 107.98,54.91 96.14,54.91 95.08,55.98 90.11,55.98 80.01,66.09 80.01,69.85 77.47,72.39 75.8,72.39 IC1.51
N$56
  Top 0.152: IC1.42 80.16,65.5 89.99,55.68 94.95,55.68 96.02,54.61 107.85,54.61 112.67,49.79 112.67,20.19 109.54,17.06 95.51,17.06 SW45.P$1
N$57
  Top 0.152: IC1.41 80.23,65 89.86,55.37 94.82,55.37 95.99,54.2 107.83,54.2 112.37,49.66 112.37,20.32 109.41,17.36 101.56,17.36 SW46.P$1
N$58
  Top 0.152: IC1.40 80.3,64.5 89.74,55.07 94.7,55.07 95.87,53.9 107.7,53.9 112.01,49.59 112.01,23.92 SW47.P$1
N$59
  Top 0.152: SW48.P$1 59.91,30.02 63.27,26.66 108.66,26.66 111.71,29.71 111.71,49.46 107.58,53.59 95.74,53.59 94.57,54.76 89.61,54.76 80.37,64 IC1.39
N$60
  Top 0.152: SW49.P$1 66.26,30.02 69.31,26.96 108.53,26.96 111.4,29.84 111.4,49.34 107.45,53.29 95.61,53.29 94.44,54.46 89.48,54.46 80.44,63.5 IC1.38
N$61
  Top 0.152: SW50.P$1 72.61,30.02 75.36,27.27 108.41,27.27 111.1,29.96 111.1,49.21 107.32,52.98 95.49,52.98 94.32,54.15 89.36,54.15 80.51,63 IC1.37
N$62
  Top 0.152: SW51.P$1 78.96,30.02 81.41,27.57 108.28,27.57 110.8,30.09 110.8,49.08 107.2,52.68 95.36,52.68 94.19,53.85 88.82,53.85 80.17,62.5 IC1.36
N$63
  Top 0.152: SW52.P$1 85.31,30.02 87.45,27.88 108.15,27.88 110.49,30.21 110.49,48.96 107.07,52.38 95.23,52.38 94.07,53.54 88.7,53.54 80.24,62 IC1.35
N$64
  Top 0.152: SW3.P$2 39.15,30.02 37.31,28.18 22.62,28.18 19.41,31.39 19.41,48.64 22.54,51.78 43.22,51.78 44.73,53.29 55.8,53.29 58.01,51.08 61.37,51.08 63.95,53.66 63.95,55.7 IC1.4
N$65
  Top 0.152: SW4.P$2 35.6,28.79 29.68,28.79 29.38,28.49 22.91,28.49 19.71,31.69 19.71,48.51 22.67,51.47 43.35,51.47 44.83,52.96 44.86,52.98 55.67,52.98 57.88,50.77 61.5,50.77 64.45,53.73 64.45,55.7 IC1.5
N$66
  Top 0.152: SW5.P$2 29.25,28.79 23.04,28.79 20.02,31.81 20.02,48.39 22.8,51.17 43.47,51.17 44.41,52.11 44.98,52.68 55.55,52.68 57.76,50.47 61.62,50.47 64.95,53.8 64.95,55.7 IC1.6
N$67
  Top 0.152: SW6.P$2 20.32,33.83 20.32,48.26 22.92,50.86 43.18,50.86 43.6,50.86 44.63,51.89 55.9,51.89 57.63,50.16 61.75,50.16 65.45,53.87 65.45,55.7 IC1.7
N$69
  Top 0.152: 68.17,38.51 SW37.P$1 SW38.P$1 | 68.17,38.51 65.69,36.02 SW49.P$2 | SW50.P$2 68.17,36.43 68.17,38.51 | SW38.P$1 74.93,36.83 | 74.93,36.83 SW51.P$2 SW50.P$2 | SW50.P$2 SW49.P$2 | SW49.P$2 SW48.P$2 51.85,36.02 50.62,34.79 48.44,34.79 47.21,36.02 SW3.P$1 SW4.P$1 SW5.P$1 SW6.P$1 | SW52.P$2 SW39.P$1 | SW39.P$1 SW40.P$1 SW41.P$1 | SW39.P$1 SW38.P$1 | SW52.P$2 83.01,36.02 85.9,38.91 SW41.P$1 | SW43.P$1 SW44.P$1 103.68,33.02 85.06,33.02 84.76,32.72 56.25,32.72 54.65,31.12 54.65,28.93 55.88,27.7 SW26.P$1 | SW43.P$1 SW42.P$1 SW41.P$1 | SW29.P$1 SW28.P$1 SW27.P$1 SW26.P$1 | SW26.P$1 SW25.P$1 SW24.P$1 SW23.P$1 76.82,24.59 78.58,26.35 92.22,26.35 SW45.P$2 SW46.P$2 SW47.P$2 103.68,21.59 36.83,21.59 35.56,20.32 35.56,12.7 | 35.56,12.7 SW7.P$1 | 35.56,12.7 36.37,11.89 SW1.P$1 SW2.P$1 52.29,11.89 53.52,13.12 100.16,13.12 101.38,11.89 SW30.P$1 | SW52.P$2 75.74,36.02 74.93,36.83 | IC1.31 76.12,59.87 75.42,59.87 75.29,59.73 75.29,57.27 75.42,57.13 82.57,57.13 87.68,52.02 93.43,52.02 94.65,50.8 106.49,50.8 108.91,48.38 108.91,41.15 SW43.P$1
N$72
  Top 0.152: SW53.P$1 31.75,17.32 31.75,6.35 36.83,1.27 108.02,1.27 119.73,12.98 119.73,52.24 110.65,61.32 98.8,61.32 97.68,62.43 92.84,62.43 86.41,68.86 86.41,72.39 86.41,72.5 79.92,78.99 59.94,78.99 54.61,73.66 54.61,72.39 59,68 IC1.79
N$73
  Bottom 0.152: DIS2.3 32.28,65.01 35.99,65.01 38.1,67.12 S1.1
N$74
  Top 0.152: C1.2 60.94,69.87 61.74,69.87 61.87,69.73 61.87,68.94 62.23,68.58 62.23,67.62 61.74,67.13 60.78,67.13 | 67.45,55.96 IC1.11 67.71,55.96 67.71,56.22 | 67.45,55.96 67.45,56.66 66.11,58 IC1.99 | 67.71,56.22 67.45,55.96 | 67.84,56.79 71.42,60.37 76.12,60.37 IC1.32 | JP9.1 70.76,56.79 67.84,56.79 | 67.84,56.79 67.71,56.66 67.71,56.22 | 60.78,67.13 IC1.81 | QF1.2 60.28,79.3 59.82,79.3 57.61,77.09 51.04,77.09 50.52,76.57 50.52,75.83 51.04,75.31 52.34,75.31 54,73.65 54,72.14 57.56,68.58 | 60.78,67.13 59.01,67.13 57.56,68.58 | IC1.62 68.95,71.04 68.95,70.34 68.58,69.97 JP8.1 | JP11.1 57.56,68.58
  Bottom 0.152: QF1.2 60.26,80.01 59.43,80.84 58.74,80.84 58.25,80.35 58.25,79.66 59.69,78.23 C2.1 59.69,73.66 C1.2 59.51,72.39 60.53,71.36 69.74,71.36 72.11,68.99 72.11,68.17 71.53,67.59 70.54,67.59 69.55,68.58 JP8.1 72.39,64.77 JP9.1
N$75
  Top 0.152: C1.1 62.21,71.14 62.21,70.34 71.05,61.5 IC1.34
  Bottom 0.152: QF1.3 60.96,78.13 C1.1
N$76
  Top 0.152: IC1.33 76.12,61.13 70.99,61.13 60.76,71.36 60.53,71.36 59.93,71.96 59.93,72.82 62.23,75.11 C2.2
  Bottom 0.152: C2.2 62.23,79.4 QF1.1
N$78
  Top 0.152: IC2.1 50.8,67.31 R3.2
N$79
  Top 0.152: R1.1 42.73,68.58 IC2.8
N$80
  Top 0.152: IC2.7 42.73,71.12 R2.1
N$81
  Top 0.152: IC2.5 43.63,76.2 R2.2 R1.2 38.55,68.58 C4.1
  Bottom 0.152: IC2.5 42.34,76.2 41.17,77.37 33.88,77.37 28.09,71.58 28.09,70.96 27.13,70 26.21,70 25.55,70.66 25.55,71.71 24.72,72.54 18.89,72.54 15.39,69.04 15.39,54.19 17.78,51.8 17.78,31.75 24.96,24.57 CN1.VBUS
N$83
  Top 0.152: DIS2.13 53.17,60.5 IC1.94
N$84
  Top 0.152: DIS2.14 50.09,56.15 53.94,60 IC1.95
N$85
  Top 0.152: C4.2 36.83,67.31 R3.1
  Bottom 0.152: C4.2 C3.2 JP1.1 | JP1.1 28.23,66.04 DIS2.1 18.61,53.34 58.71,53.34 DIS2.18 | JP1.1 25.25,70 25.25,71.58 24.59,72.24 21.13,72.24 20.01,71.12 JP2.6 | DIS2.18 62.51,52.62 | CN1.GND 25.73,19.49 30.21,19.49 62.26,51.53 62.26,52.61 60.25,54.61 DIS2.18
N$86
  Bottom 0.152: JP3.1 20.32,85.09 77.51,85.09 SP1.P$2
N$87
  Bottom 0.152: JP3.2 20.63,83.82 19.51,82.7 18.59,82.7 17.93,83.36 17.93,84.28 20.01,86.36 81.24,86.36 SP1.P$1
N$88
  Bottom 0.152: M1.2 19.05,6.35 13.97,11.43 13.97,76.2 16.51,78.74 19.05,78.74 JP3.3
N$89
  Bottom 0.152: M1.1 27.94,7.62 20.32,7.62 15.09,12.85 15.09,69.17 16.51,70.59 16.51,77.47 17.48,78.43 20.33,78.43 25.71,83.82 JP3.4
N$90
  Top 0.152: DIS2.15 52.63,57.42 54.71,59.5 IC1.96
N$91
  Top 0.152: IC1.9 66.45,55.96 66.45,56.66 65.96,57.15 62.23,57.15 61.76,57.15 61.74,57.13 57.42,57.13 DIS2.16
Q
  pour Bottom: 7.62,90.17 120.65,90.17 120.65,5.08 120.65,0 20.32,0 7.62,0